# Altium project industrial_stepper_driver.PrjPcb
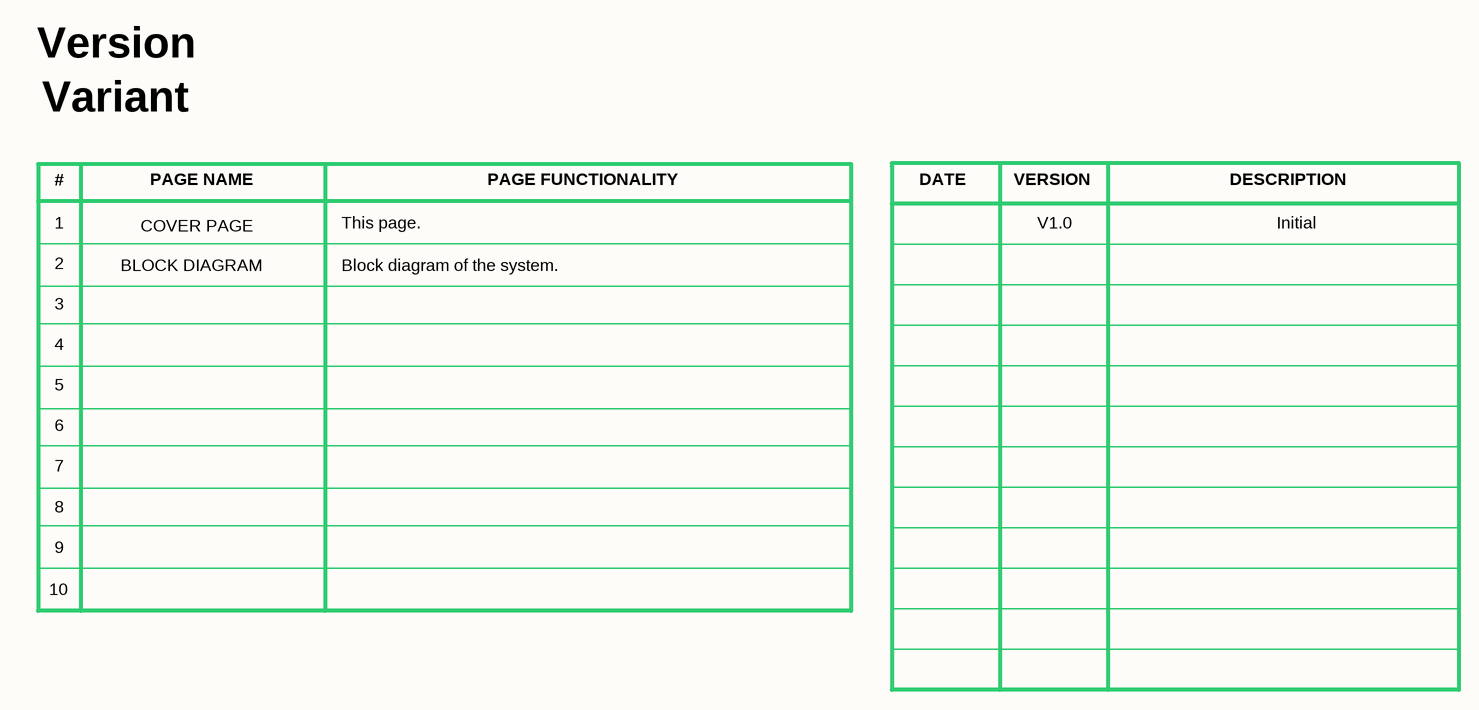
[diagram p0: 01 COVER PAGE.SchDoc]
Engineer_Email: contact@silardgal.com; Engineer_Link: https://www.silardgal.com; Engineer_Name: Silard Gal; Global_version: 1.0
6 sheets, 109 parts. Net scope: flat (ports and power ports of the same name join across sheets).
Board file: industrial_stepper_driver.PcbDoc
Sheets:
  01 COVER PAGE.SchDoc
  02 BLOCK DIAGRAM.SchDoc
  03 MCU.SchDoc
  04 DRIVER.SchDoc
  05 COMMUNICATION.SchDoc
  06 POWER.SchDoc

## Sheet 01 COVER PAGE.SchDoc: COVER PAGE
size 420 x 297 mm; SheetNumber: 1; SheetTotal: 5

### Notes on the sheet
- Version
- Variant
- #
- 1
- PAGE NAME
- COVER PAGE
- This page.
- PAGE FUNCTIONALITY
- DATE
- VERSION
- V1.0
- DESCRIPTION
- Initial
- 2
- 3
- BLOCK DIAGRAM
- Block diagram of the system.
- 4
- 5
- 6
- 7
- 8
- 9
- 10
- Title
- Project
- Size
- Date
- Revision
- A3
- Designed By

## Sheet 02 BLOCK DIAGRAM.SchDoc: BLOCK DIAGRAM
size 420 x 297 mm; SheetNumber: 2; SheetTotal: 5

### Notes on the sheet
- Title
- Project
- Size
- Date
- Revision
- A3
- Designed By

## Sheet 03 MCU.SchDoc: MCU
size 420 x 297 mm; SheetNumber: 3; SheetTotal: 6
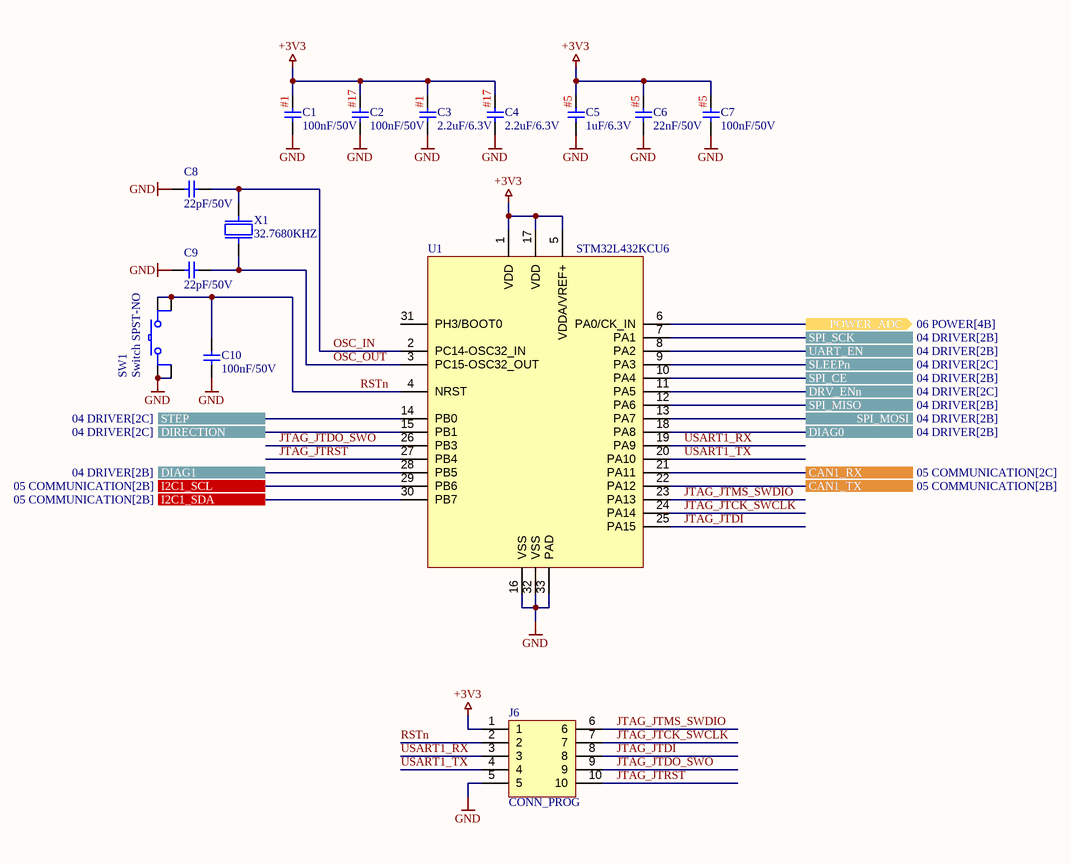
[diagram p1: 03 MCU.SchDoc]

### Parts
C1  100nF/50V  [CAPC1005X06M-0402]
C2  100nF/50V  [CAPC1005X06M-0402]
C3  2.2uF/6.3V  [CAPC1005X06M-0402]
C4  2.2uF/6.3V  [CAPC1005X06M-0402]
C5  1uF/6.3V  [CAPC1005X06M-0402]
C6  22nF/50V  [CAPC1005X06M-0402]
C7  100nF/50V  [CAPC1005X06M-0402]
C8  22pF/50V  [CAPC1005X06M-0402]
C9  22pF/50V  [CAPC1005X06M-0402]
C10  100nF/50V  [CAPC1005X06M-0402]
J6  CONN_PROG  [CONN_PROG]
SW1  Switch SPST-NO  [PTS815 SJM 250 SMTR LFS]
U1  STM32L432KCU6  [PQFN50P500X500X60_HS-33N]
X1  32.7680KHZ  [2-SMD]

### Ports
CAN1_RX (see 05 COMMUNICATION[2C]), CAN1_TX (see 05 COMMUNICATION[2B]), DIAG0 (see 04 DRIVER[2B]), DIAG1 (see 04 DRIVER[2B]), DIRECTION (see 04 DRIVER[2C]), DRV_ENn (see 04 DRIVER[2C]), I2C1_SCL (see 05 COMMUNICATION[2B]), I2C1_SDA (see 05 COMMUNICATION[2B]), POWER_ADC (out, see 06 POWER[4B]), SLEEPn (see 04 DRIVER[2C]), SPI_CE (see 04 DRIVER[2B]), SPI_MISO (see 04 DRIVER[2B]), SPI_MOSI (see 04 DRIVER[2B]), SPI_SCK (see 04 DRIVER[2B]), STEP (see 04 DRIVER[2C]), UART_EN (see 04 DRIVER[2B])

### Nets
+3V3: C1.2 C2.2 C3.2 C4.2 C5.2 C6.2 C7.2 J6.1 U1.1(VDD) U1.5(VDDA/VREF+) U1.17(VDD)
GND: C1.1 C2.1 C3.1 C4.1 C5.1 C6.1 C7.1 C8.1 C9.1 C10.1 J6.5 SW1.1 SW1.2 U1.16(VSS) U1.32(VSS) U1.33(PAD)
DIAG0: U1.18(PA8) ; port DIAG0
DIAG1: U1.28(PB5) ; port DIAG1
DIRECTION: U1.15(PB1) ; port DIRECTION
DRV_ENn: U1.11(PA5) ; port DRV_ENn
JTAG_JTCK_SWCLK: J6.7 U1.24(PA14)
JTAG_JTDI: J6.8 U1.25(PA15)
JTAG_JTDO_SWO: J6.9 U1.26(PB3)
JTAG_JTMS_SWDIO: J6.6 U1.23(PA13)
JTAG_JTRST: J6.10 U1.27(PB4)
OSC_IN: C8.2 U1.2(PC14-OSC32_IN) X1.2
OSC_OUT: C9.2 U1.3(PC15-OSC32_OUT) X1.1
RSTn: C10.2 J6.2 SW1.3 SW1.4 U1.4(NRST)
SLEEPn: U1.9(PA3) ; port SLEEPn
SPI_CE: U1.10(PA4) ; port SPI_CE
SPI_MISO: U1.12(PA6) ; port SPI_MISO
SPI_MOSI: U1.13(PA7) ; port SPI_MOSI
SPI_SCK: U1.7(PA1) ; port SPI_SCK
STEP: U1.14(PB0) ; port STEP
UART_EN: U1.8(PA2) ; port UART_EN
USART1_RX: J6.3 U1.19(PA9)
USART1_TX: J6.4 U1.20(PA10)
NetJ7_3: U1.30(PB7) ; port I2C1_SDA
NetJ7_4: U1.29(PB6) ; port I2C1_SCL
NetR17_2: U1.6(PA0/CK_IN) ; port POWER_ADC
NetU1_21: U1.21(PA11) ; port CAN1_RX
NetU1_22: U1.22(PA12) ; port CAN1_TX

Not connected (* = marked no-connect by the designer): U1 31(PH3/BOOT0)

### Notes on the sheet
- (near C1) #1
- (near C2) #17
- (near C3) #1
- (near C4) #17
- (near C5) #5
- (near C6) #5
- (near C7) #5
- Title
- Project
- Size
- Date
- Revision
- A3
- Designed By

### Library data of the parts
C1 C2 C7 C10 = GRM155R71H104KE14D: 0.1 µF ±10% 50V Ceramic Capacitor X7R 0402 (1005 Metric); ComponentLink1Description: Datasheet; ComponentLink1URL: https://search.murata.co.jp/Ceramy/image/img/A01X/G101/ENG/GRM155R60J475ME47-01.pdf; MPN: GRM155R71H104KE14D
C3 C4 = GRM155C80J225KE95D: 2.2 µF ±10% 6.3V Ceramic Capacitor X6S 0402 (1005 Metric); ComponentLink1Description: Datasheet; ComponentLink1URL: https://search.murata.co.jp/Ceramy/image/img/A01X/G101/ENG/GRM155R60J475ME47-01.pdf; MPN: GRM155C80J225KE95D
C5 = GRM155R70J105KA12J: 1 µF ±10% 6.3V Ceramic Capacitor X7R 0402 (1005 Metric); ComponentLink1Description: Datasheet; ComponentLink1URL: https://search.murata.co.jp/Ceramy/image/img/A01X/G101/ENG/GRM155R60J475ME47-01.pdf; MPN: GRM155R70J105KA12J
C6 = GRM155R71H223KA12D: 0.022 µF ±10% 50V Ceramic Capacitor X7R 0402 (1005 Metric); ComponentLink1Description: Datasheet; ComponentLink1URL: https://search.murata.co.jp/Ceramy/image/img/A01X/G101/ENG/GRM155R60J475ME47-01.pdf; MPN: GRM155R71H223KA12D
C8 C9 = GRM1555C1H220JA01D: 22 pF ±5% 50V Ceramic Capacitor C0G, NP0 0402 (1005 Metric); ComponentLink1Description: Datasheet; ComponentLink1URL: https://search.murata.co.jp/Ceramy/image/img/A01X/G101/ENG/GRM155R60J475ME47-01.pdf; MPN: GRM1555C1H220JA01D
SW1 = PTS815 SJM 250 SMTR LFS: Tactile Switch SPST-NO Top Actuated Surface Mount; ComponentLink1Description: Datasheet; ComponentLink1URL: https://www.ckswitches.com/media/2728/pts815.pdf; MPN: PTS815 SJM 250 SMTR LFS
U1 = STM32L432KCU6: ARM® Cortex®-M4 STM32L4 Microcontroller IC 32-Bit Single-Core 80MHz 256KB (256K x 8) FLASH 32-UFQFPN (5x5); ComponentLink1Description: Datasheet; ComponentLink1URL: https://www.st.com/content/ccc/resource/technical/document/datasheet/24/01/9f/59/f0/83/47/fc/DM00257205.pdf/files/DM00257205.pdf/jcr:content/translations/en.DM00257205.pdf; MPN: STM32L432KCU6
X1 = ECS-.327-12.5-16-TR: 32.768 kHz ±20ppm Crystal 12.5pF 90 kOhms 2-SMD, No Lead; ComponentLink1Description: Datasheet; ComponentLink1URL: https://ecsxtal.com/store/pdf/ECX-16.pdf; MPN: ECS-.327-12.5-16-TR
J6 = CONN_PROG: ComponentLink1Description: Datasheet; MPN: CONN_PROG

## Sheet 04 DRIVER.SchDoc: DRIVER
size 420 x 297 mm; SheetNumber: 4; SheetTotal: 6
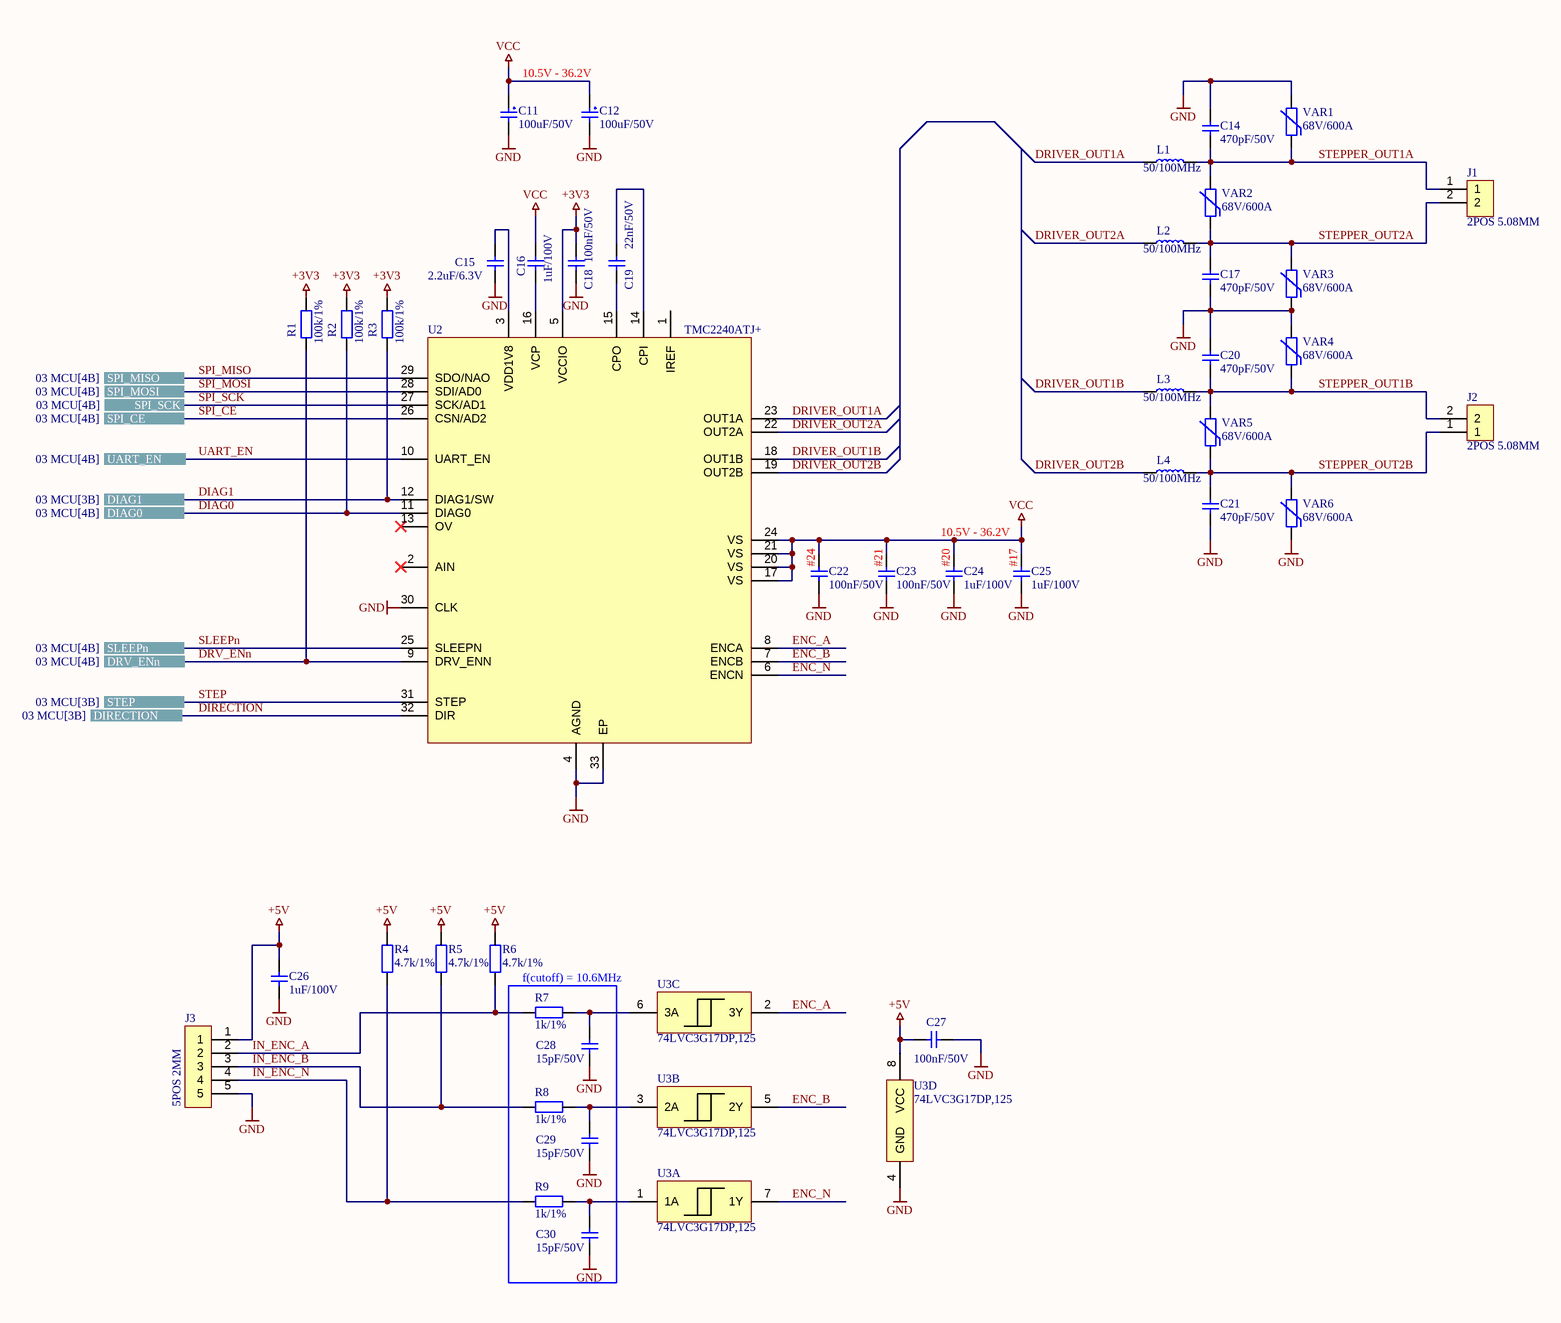
[diagram p2: 04 DRIVER.SchDoc]

### Parts
C11  100uF/50V  [A768KS107M1HLAE030]
C12  100uF/50V  [A768KS107M1HLAE030]
C14  470pF/50V  [CAPC1005X06M-0402]
C15  2.2uF/6.3V  [CAPC1005X06M-0402]
C16  1uF/100V  [CAPC2012X14M]
C17  470pF/50V  [CAPC1005X06M-0402]
C18  100nF/50V  [CAPC1005X06M-0402]
C19  22nF/50V  [CAPC1005X06M-0402]
C20  470pF/50V  [CAPC1005X06M-0402]
C21  470pF/50V  [CAPC1005X06M-0402]
C22  100nF/50V  [CAPC1005X06M-0402]
C23  100nF/50V  [CAPC1005X06M-0402]
C24  1uF/100V  [CAPC2012X14M]
C25  1uF/100V  [CAPC2012X14M]
C26  1uF/100V  [CAPC2012X14M]
C27  100nF/50V  [CAPC1005X06M-0402]
C28  15pF/50V  [CAPC1005X06M-0402]
C29  15pF/50V  [CAPC1005X06M-0402]
C30  15pF/50V  [CAPC1005X06M-0402]
J1  2POS 5.08MM  [282837-2]
J2  2POS 5.08MM  [282837-2]
J3  5POS 2MM  [B5B-PH-K-S]
L1  50/100MHz  [INDC3200X110-1206]
L2  50/100MHz  [INDC3200X110-1206]
L3  50/100MHz  [INDC3200X110-1206]
L4  50/100MHz  [INDC3200X110-1206]
R1  100k/1%  [RESC1005X04M-0402]
R2  100k/1%  [RESC1005X04M-0402]
R3  100k/1%  [RESC1005X04M-0402]
R4  4.7k/1%  [RESC1005X04M-0402]
R5  4.7k/1%  [RESC1005X04M-0402]
R6  4.7k/1%  [RESC1005X04M-0402]
R7  1k/1%  [RESC1005X04M-0402]
R8  1k/1%  [RESC1005X04M-0402]
R9  1k/1%  [RESC1005X04M-0402]
U2  TMC2240ATJ+  [TQFN32-5mmx5mm]
U3  74LVC3G17DP,125  [TSOP65P400X110-8N]  (parts A,B,C,D of 4)
VAR1  68V/600A  [VARA4732X16N]
VAR2  68V/600A  [VARA4732X16N]
VAR3  68V/600A  [VARA4732X16N]
VAR4  68V/600A  [VARA4732X16N]
VAR5  68V/600A  [VARA4732X16N]
VAR6  68V/600A  [VARA4732X16N]

### Blocks framed on the sheet
f(cutoff) = 10.6MHz: C28-C30 R7-R9

### Ports
DIAG0 (see 03 MCU[4B]), DIAG1 (see 03 MCU[3B]), DIRECTION (see 03 MCU[3B]), DRV_ENn (see 03 MCU[4B]), SLEEPn (see 03 MCU[4B]), SPI_CE (see 03 MCU[4B]), SPI_MISO (see 03 MCU[4B]), SPI_MOSI (see 03 MCU[4B]), SPI_SCK (see 03 MCU[4B]), STEP (see 03 MCU[3B]), UART_EN (see 03 MCU[4B])

### Nets
+3V3: C18.2 R1.2 R2.2 R3.2 U2.5(VCCIO)
+5V: C26.2 C27.1 J3.1 R4.2 R5.2 R6.2 U3.8(VCC)
GND: C11.2 C12.2 C14.1 C15.1 C17.2 C18.1 C20.1 C21.2 C22.1 C23.1 C24.1 C25.1 C26.1 C27.2 C28.1 C29.1 C30.1 J3.5 U2.4(AGND) U2.30(CLK) U2.33(EP) U3.4(GND) VAR1.2 VAR3.1 VAR4.2 VAR6.1
VCC: C11.1 C12.1 C16.2 C22.2 C23.2 C24.2 C25.2 U2.17(VS) U2.20(VS) U2.21(VS) U2.24(VS)
DIAG0: R2.1 U2.11(DIAG0) ; port DIAG0
DIAG1: R3.1 U2.12(DIAG1/SW) ; port DIAG1
DIRECTION: U2.32(DIR) ; port DIRECTION
DRIVER_OUT1A: L1.1 U2.23(OUT1A)
DRIVER_OUT1B: L3.1 U2.18(OUT1B)
DRIVER_OUT2A: L2.1 U2.22(OUT2A)
DRIVER_OUT2B: L4.1 U2.19(OUT2B)
DRV_ENn: R1.1 U2.9(DRV_ENN) ; port DRV_ENn
ENC_A: U2.8(ENCA) U3.2(3Y)
ENC_B: U2.7(ENCB) U3.5(2Y)
ENC_N: U2.6(ENCN) U3.7(1Y)
IN_ENC_A: J3.2 R6.1 R7.1
IN_ENC_B: J3.3 R5.1 R8.1
IN_ENC_N: J3.4 R4.1 R9.1
SLEEPn: U2.25(SLEEPN) ; port SLEEPn
SPI_CE: U2.26(CSN/AD2) ; port SPI_CE
SPI_MISO: U2.29(SDO/NAO) ; port SPI_MISO
SPI_MOSI: U2.28(SDI/AD0) ; port SPI_MOSI
SPI_SCK: U2.27(SCK/AD1) ; port SPI_SCK
STEP: U2.31(STEP) ; port STEP
STEPPER_OUT1A: C14.2 J1.1 L1.2 VAR1.1 VAR2.2
STEPPER_OUT1B: C20.2 J2.2 L3.2 VAR4.1 VAR5.2
STEPPER_OUT2A: C17.1 J1.2 L2.2 VAR2.1 VAR3.2
STEPPER_OUT2B: C21.1 J2.1 L4.2 VAR5.1 VAR6.2
UART_EN: U2.10(UART_EN) ; port UART_EN
NetC15_2: C15.2 U2.3(VDD1V8)
NetC16_1: C16.1 U2.16(VCP)
NetC19_1: C19.1 U2.15(CPO)
NetC19_2: C19.2 U2.14(CPI)
NetC28_2: C28.2 R7.2 U3.6(3A)
NetC29_2: C29.2 R8.2 U3.3(2A)
NetC30_2: C30.2 R9.2 U3.1(1A)

Not connected (* = marked no-connect by the designer): U2 1(IREF) 2(AIN)* 13(OV)*

### Notes on the sheet
- 10.5V - 36.2V
- (near C22) #24
- (near C23) #21
- (near C24) #20
- (near C25) #17
- Title
- Project
- Size
- Date
- Revision
- A3
- Designed By

### Library data of the parts
C11 C12 = A768KS107M1HLAE030: 100 µF 50 V Aluminum - Polymer Capacitors Radial, Can - SMD 30mOhm 2000 Hrs @ 125°C; ComponentLink1Description: Datasheet; ComponentLink1URL: https://connect.kemet.com:7667/gateway/IntelliData-ComponentDocumentation/1.0/download/datasheet/A768KS107M1HLAE030; MPN: A768KS107M1HLAE030
C14 C17 C20 C21 = GRM155R71H471KA01D: 470 pF ±10% 50V Ceramic Capacitor X7R 0402 (1005 Metric); ComponentLink1Description: Datasheet; ComponentLink1URL: https://search.murata.co.jp/Ceramy/image/img/A01X/G101/ENG/GRM155R60J475ME47-01.pdf; MPN: GRM155R71H471KA01D
C15 = GRM155C80J225KE95D: as C3 on sheet 03 MCU; ComponentLink1Description: Datasheet; ComponentLink1URL: https://search.murata.co.jp/Ceramy/image/img/A01X/G101/ENG/GRM155R60J475ME47-01.pdf; MPN: GRM155C80J225KE95D
C16 C24-C26 = GRM21BC72A105KE01L: 1 µF ±10% 100V Ceramic Capacitor X7S 0805 (2012 Metric); ComponentLink1Description: Datasheet; ComponentLink1URL: https://search.murata.co.jp/Ceramy/image/img/A01X/G101/ENG/GRM21BC72A105KE01-01.pdf; MPN: GRM21BC72A105KE01L
C18 C22 C23 C27 = GRM155R71H104KE14D: as C1 on sheet 03 MCU; ComponentLink1Description: Datasheet; ComponentLink1URL: https://search.murata.co.jp/Ceramy/image/img/A01X/G101/ENG/GRM155R60J475ME47-01.pdf; MPN: GRM155R71H104KE14D
C19 = GRM155R71H223KA12D: as C6 on sheet 03 MCU; ComponentLink1Description: Datasheet; ComponentLink1URL: https://search.murata.co.jp/Ceramy/image/img/A01X/G101/ENG/GRM155R60J475ME47-01.pdf; MPN: GRM155R71H223KA12D
C28-C30 = GRM1555C1H150JA01D: 15 pF ±5% 50V Ceramic Capacitor C0G, NP0 0402 (1005 Metric); ComponentLink1Description: Datasheet; ComponentLink1URL: https://search.murata.co.jp/Ceramy/image/img/A01X/G101/ENG/GRM155R60J475ME47-01.pdf; MPN: GRM1555C1H150JA01D
J1 J2 = 282837-2: MPN: 282834-3; ComponentLink1Description: Datasheet; ComponentLink1URL: https://www.te.com/commerce/DocumentDelivery/DDEController?Action=srchrtrv&DocNm=282834&DocType=Customer+Drawing&DocLang=English
J3 = B5B-PH-K-S: Connector Header Through Hole 5 position 0.079" (2.00mm); ComponentLink1Description: Datasheet; ComponentLink1URL: https://www.jst-mfg.com/product/pdf/eng/ePH.pdf; MPN: B5B-PH-K-S
L1-L4 = 742792114: 50 Ohms 1 Signal Line Ferrite Bead 1206 (3216 Metric) 3A 25mOhm; ComponentLink1Description: Datasheet; ComponentLink1URL: https://www.we-online.com/katalog/datasheet/742792114.pdf; MPN: 742792114
R1-R3 = RC0402FR-07100KL: 100 kOhms ±1% 0.063W, 1/16W Chip Resistor 0402 (1005 Metric) Moisture Resistant Thick Film; ComponentLink1Description: Datasheet; ComponentLink1URL: https://www.yageo.com/upload/media/product/productsearch/datasheet/rchip/PYu-RC_Group_51_RoHS_L_12.pdf; MPN: RC0402FR-07100KL
R4-R6 = RC0402FR-074K7L: 4.7 kOhms ±1% 0.063W, 1/16W Chip Resistor 0402 (1005 Metric) Moisture Resistant Thick Film; ComponentLink1Description: Datasheet; ComponentLink1URL: https://www.yageo.com/upload/media/product/productsearch/datasheet/rchip/PYu-RC_Group_51_RoHS_L_12.pdf; MPN: RC0402FR-074K7L
R7-R9 = RC0402FR-071KL: 1 kOhms ±1% 0.063W, 1/16W Chip Resistor 0402 (1005 Metric) Moisture Resistant Thick Film; ComponentLink1Description: Datasheet; ComponentLink1URL: https://www.yageo.com/upload/media/product/productsearch/datasheet/rchip/PYu-RC_Group_51_RoHS_L_12.pdf; MPN: RC0402FR-071KL
U2 = TMC2240ATJ+: Bipolar Motor Driver Power MOSFET SPI, UART 32-TQFN-EP (5x5); MPN: TMC2240ATJ+; ComponentLink1Description: Datasheet; ComponentLink1URL: http://mm.digikey.com/Volume0/opasdata/d220001/medias/docus/5344/TMC2240.pdf
U3 = 74LVC3G17DP,125: Buffer, Non-Inverting 3 Element 1 Bit per Element Push-Pull Output 8-TSSOP; ComponentLink1Description: Datasheet; ComponentLink1URL: https://assets.nexperia.com/documents/data-sheet/74LVC3G17.pdf; MPN: 74LVC3G17DP,125
VAR1-VAR6 = ZV40K1812601NIR1: 68 V 600 A Varistor 1 Circuit Surface Mount, MLCV 1812 (4532 Metric); ComponentLink1Description: Datasheet; ComponentLink1URL: https://www.bourns.com/docs/Product-Datasheets/ZV_series.pdf; MPN: ZV40K1812601NIR1

## Sheet 05 COMMUNICATION.SchDoc: COMMUNICATION
size 420 x 297 mm; SheetNumber: 5; SheetTotal: 6
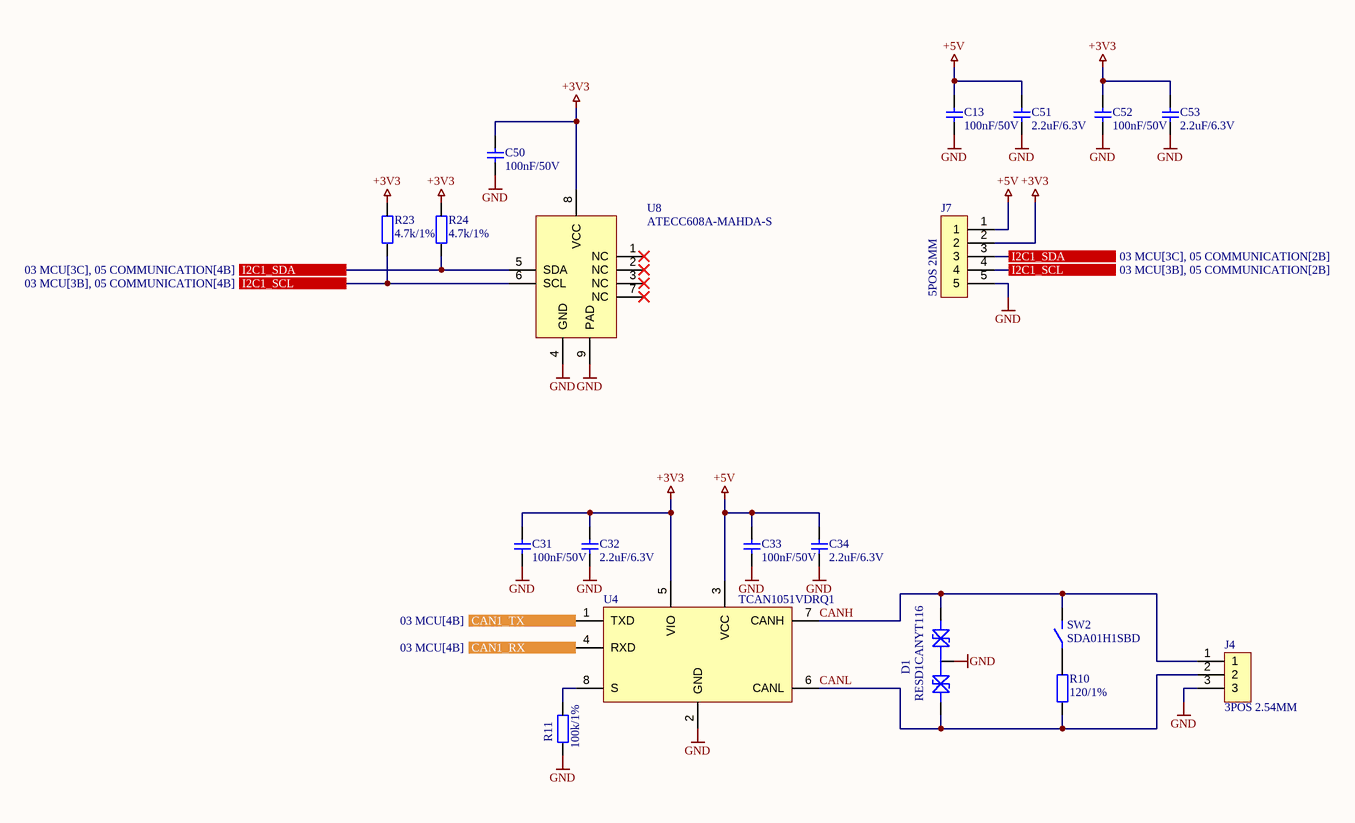
[diagram p3: 05 COMMUNICATION.SchDoc]

### Parts
C13  100nF/50V  [CAPC1005X06M-0402]
C31  100nF/50V  [CAPC1005X06M-0402]
C32  2.2uF/6.3V  [CAPC1005X06M-0402]
C33  100nF/50V  [CAPC1005X06M-0402]
C34  2.2uF/6.3V  [CAPC1005X06M-0402]
C50  100nF/50V  [CAPC1005X06M-0402]
C51  2.2uF/6.3V  [CAPC1005X06M-0402]
C52  100nF/50V  [CAPC1005X06M-0402]
C53  2.2uF/6.3V  [CAPC1005X06M-0402]
D1  RESD1CANYT116  [SOT100P240X115-3N]
J4  3POS 2.54MM  [282834-3]
J7  5POS 2MM  [B5B-PH-K-S]
R10  120/1%  [RESC1005X04M-0402]
R11  100k/1%  [RESC1005X04M-0402]
R23  4.7k/1%  [RESC1005X04M-0402]
R24  4.7k/1%  [RESC1005X04M-0402]
SW2  SDA01H1SBD  [SDA01H1SB]
U4  TCAN1051VDRQ1  [SOIC127P600X175-8N]
U8  ATECC608A-MAHDA-S  [SON50P200X60_HS-9N]

### Ports
CAN1_RX (see 03 MCU[4B]), CAN1_TX (see 03 MCU[4B]), I2C1_SCL (see 03 MCU[3B], 05 COMMUNICATION[2B]), I2C1_SCL (see 03 MCU[3B], 05 COMMUNICATION[4B]), I2C1_SDA (see 03 MCU[3C], 05 COMMUNICATION[2B]), I2C1_SDA (see 03 MCU[3C], 05 COMMUNICATION[4B])

### Nets
+3V3: C31.2 C32.2 C50.2 C52.2 C53.2 J7.2 R23.2 R24.2 U4.5(VIO) U8.8(VCC)
+5V: C13.2 C33.2 C34.2 C51.2 J7.1 U4.3(VCC)
GND: C13.1 C31.1 C32.1 C33.1 C34.1 C50.1 C51.1 C52.1 C53.1 D1.3 J4.3 J7.5 R11.1 U4.2(GND) U8.4(GND) U8.9(PAD)
CANH: D1.1 J4.1 SW2.2 U4.7(CANH)
CANL: D1.2 J4.2 R10.1 U4.6(CANL)
NetJ7_3: J7.3 R24.1 U8.5(SDA) ; port I2C1_SDA
NetJ7_4: J7.4 R23.1 U8.6(SCL) ; port I2C1_SCL
NetR10_2: R10.2 SW2.1
NetR11_2: R11.2 U4.8(S)
NetU1_21: U4.4(RXD) ; port CAN1_RX
NetU1_22: U4.1(TXD) ; port CAN1_TX

Not connected (* = marked no-connect by the designer): U8 1(NC)* 2(NC)* 3(NC)* 7(NC)*

### Notes on the sheet
- Title
- Project
- Size
- Date
- Revision
- A3
- Designed By

### Library data of the parts
C13 C31 C33 C50 C52 = GRM155R71H104KE14D: as C1 on sheet 03 MCU; ComponentLink1Description: Datasheet; ComponentLink1URL: https://search.murata.co.jp/Ceramy/image/img/A01X/G101/ENG/GRM155R60J475ME47-01.pdf; MPN: GRM155R71H104KE14D
C32 C34 C51 C53 = GRM155C80J225KE95D: as C3 on sheet 03 MCU; ComponentLink1Description: Datasheet; ComponentLink1URL: https://search.murata.co.jp/Ceramy/image/img/A01X/G101/ENG/GRM155R60J475ME47-01.pdf; MPN: GRM155C80J225KE95D
D1 = RESD1CANYT116: 44V Clamp 8A (8/20µs) Ipp Tvs Diode Surface Mount SOT-23; ComponentLink1Description: Datasheet; ComponentLink1URL: https://fscdn.rohm.com/en/products/databook/datasheet/discrete/diode/zener/resd1canyt116-e.pdf; MPN: RESD1CANYT116
J4 = 282834-3: 3 Position Wire to Board Terminal Block Horizontal with Board 0.100" (2.54mm) Through Hole; ComponentLink1Description: Datasheet; ComponentLink1URL: https://www.te.com/commerce/DocumentDelivery/DDEController?Action=srchrtrv&DocNm=282834&DocType=Customer+Drawing&DocLang=English; MPN: 282834-3
J7 = B5B-PH-K-S: as J3 on sheet 04 DRIVER; ComponentLink1Description: Datasheet; ComponentLink1URL: https://www.jst-mfg.com/product/pdf/eng/ePH.pdf; MPN: B5B-PH-K-S
R10 = RC0402FR-07120RL: 120 Ohms ±1% 0.063W, 1/16W Chip Resistor 0402 (1005 Metric) Moisture Resistant Thick Film; ComponentLink1Description: Datasheet; ComponentLink1URL: https://www.yageo.com/upload/media/product/productsearch/datasheet/rchip/PYu-RC_Group_51_RoHS_L_12.pdf; MPN: RC0402FR-07120RL
R11 = RC0402FR-07100KL: as R1 on sheet 04 DRIVER; ComponentLink1Description: Datasheet; ComponentLink1URL: https://www.yageo.com/upload/media/product/productsearch/datasheet/rchip/PYu-RC_Group_51_RoHS_L_12.pdf; MPN: RC0402FR-07100KL
R23 R24 = RC0402FR-074K7L: as R4 on sheet 04 DRIVER; ComponentLink1Description: Datasheet; ComponentLink1URL: https://www.yageo.com/upload/media/product/productsearch/datasheet/rchip/PYu-RC_Group_51_RoHS_L_12.pdf; MPN: RC0402FR-074K7L
SW2 = SDA01H1SBD: Dip Switch SPST 1 Position Surface Mount Slide (Standard) Actuator 25mA 24VDC; ComponentLink1Description: Datasheet; ComponentLink1URL: https://www.ckswitches.com/media/1327/sda.pdf; MPN: SDA01H1SBD
U4 = TCAN1051VDRQ1: 1/1 Transceiver Half CANbus 8-SOIC; ComponentLink1Description: Datasheet; ComponentLink1URL: https://www.ti.com/general/docs/suppproductinfo.tsp?distId=10&gotoUrl=https%3A%2F%2Fwww.ti.com%2Flit%2Fgpn%2Ftcan1051-q1; MPN: TCAN1051VDRQ1
U8 = ATECC608A-MAHDA-S: Authentication Chip 8-UDFN (2x3); MPN: ATECC608A-MAHDA-S; ComponentLink1Description: Datasheet; ComponentLink1URL: https://ww1.microchip.com/downloads/en/DeviceDoc/ATECC608A-CryptoAuthentication-Device-Summary-Data-Sheet-DS40001977B.pdf

## Sheet 06 POWER.SchDoc: POWER
size 420 x 297 mm; SheetNumber: 6; SheetTotal: 6
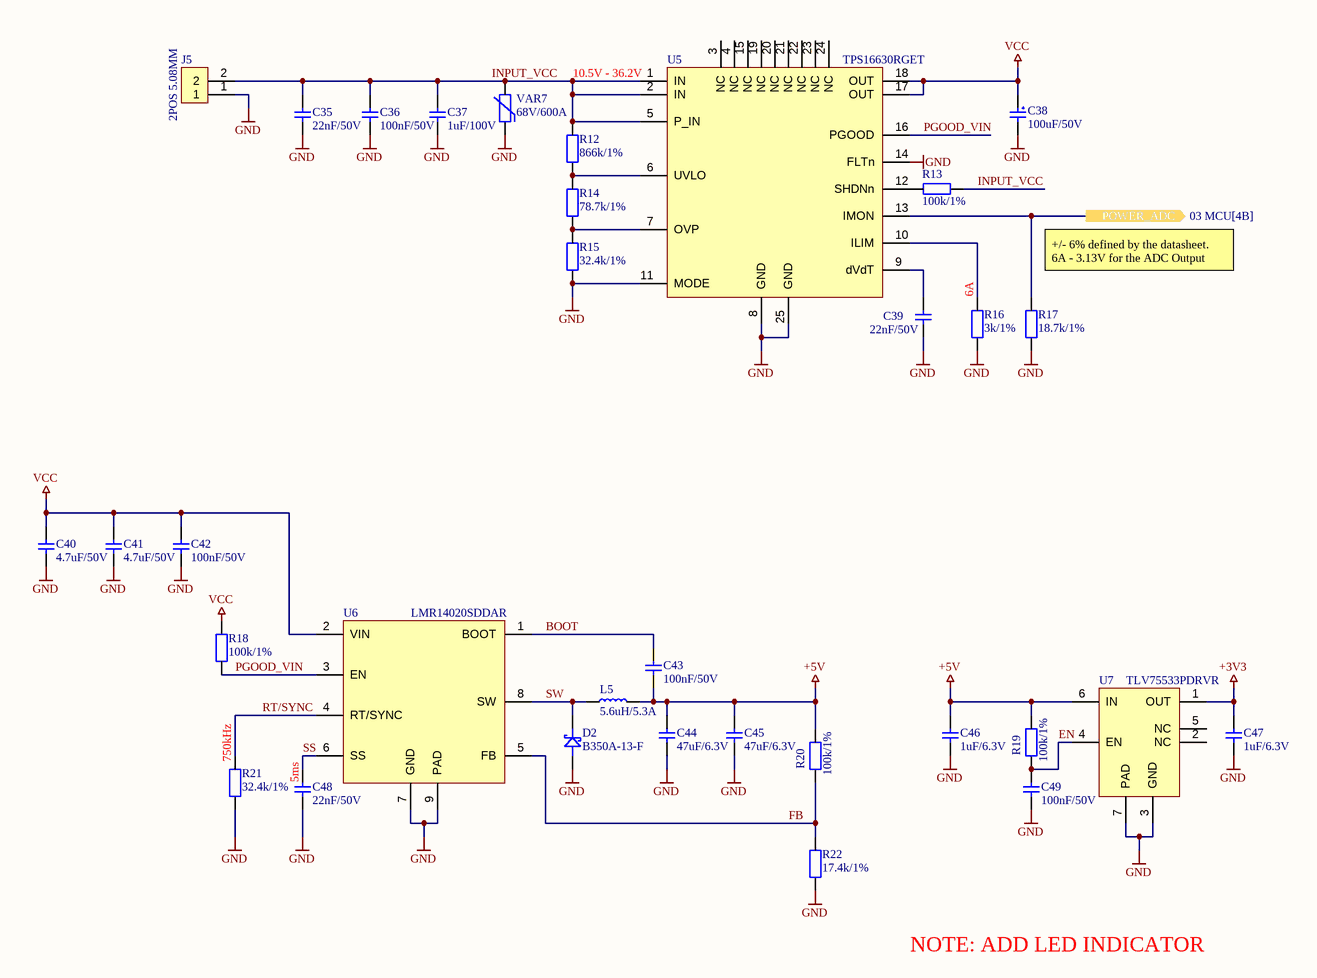
[diagram p4: 06 POWER.SchDoc]

### Parts
C35  22nF/50V  [CAPC1005X06M-0402]
C36  100nF/50V  [CAPC1005X06M-0402]
C37  1uF/100V  [CAPC2012X14M]
C38  100uF/50V  [A768KS107M1HLAE030]
C39  22nF/50V  [CAPC1005X06M-0402]
C40  4.7uF/50V  [CAPC2012X14M]
C41  4.7uF/50V  [CAPC2012X14M]
C42  100nF/50V  [CAPC1005X06M-0402]
C43  100nF/50V  [CAPC1005X06M-0402]
C44  47uF/6.3V  [CAPC1608X10M-0603]
C45  47uF/6.3V  [CAPC1608X10M-0603]
C46  1uF/6.3V  [CAPC1005X06M-0402]
C47  1uF/6.3V  [CAPC1005X06M-0402]
C48  22nF/50V  [CAPC1005X06M-0402]
C49  100nF/50V  [CAPC1005X06M-0402]
D2  B350A-13-F  [SMA]
J5  2POS 5.08MM  [282837-2]
L5  5.6uH/5.3A  [IHLP2525CZER5R6M8A]
R12  866k/1%  [RESC1005X04M-0402]
R13  100k/1%  [RESC1005X04M-0402]
R14  78.7k/1%  [RESC1005X04M-0402]
R15  32.4k/1%  [RESC1005X04M-0402]
R16  3k/1%  [RESC1005X04M-0402]
R17  18.7k/1%  [RESC1005X04M-0402]
R18  100k/1%  [RESC1005X04M-0402]
R19  100k/1%  [RESC1005X04M-0402]
R20  100k/1%  [RESC1005X04M-0402]
R21  32.4k/1%  [RESC1005X04M-0402]
R22  17.4k/1%  [RESC1005X04M-0402]
U5  TPS16630RGET  [PQFN50P400X400X100_HS-25N]
U6  LMR14020SDDAR  [SOIC127P600X170_HS-9N]
U7  TLV75533PDRVR  [SON65P200X80_HS-7N]
VAR7  68V/600A  [VARA4732X16N]

### Ports
POWER_ADC (out, see 03 MCU[4B])

### Nets
+3V3: C47.2 U7.1(OUT)
+5V: C43.1 C44.2 C45.2 C46.2 L5.2 R19.2 R20.2 U7.6(IN)
GND: C35.1 C36.1 C37.1 C38.2 C39.1 C40.1 C41.1 C42.1 C44.1 C45.1 C46.1 C47.1 C48.2 C49.1 D2.2 J5.1 R15.1 R16.1 R17.1 R21.1 R22.1 U5.8(GND) U5.11(MODE) U5.14(FLTn) U5.25(GND) U6.7(GND) U6.9(PAD) U7.3(GND) U7.7(PAD) VAR7.1
VCC: C38.1 C40.2 C41.2 C42.2 R18.1 U5.17(OUT) U5.18(OUT) U6.2(VIN)
BOOT: C43.2 U6.1(BOOT)
EN: C49.2 R19.1 U7.4(EN)
FB: R20.1 R22.2 U6.5(FB)
INPUT_VCC: C35.2 C36.2 C37.2 J5.2 R12.2 R13.1 U5.1(IN) U5.2(IN) U5.5(P_IN) VAR7.2
PGOOD_VIN: R18.2 U5.16(PGOOD) U6.3(EN)
RT/SYNC: R21.2 U6.4(RT/SYNC)
SS: C48.1 U6.6(SS)
SW: D2.1 L5.1 U6.8(SW)
NetC39_2: C39.2 U5.9(dVdT)
NetR12_1: R12.1 R14.2 U5.6(UVLO)
NetR13_2: R13.2 U5.12(SHDNn)
NetR14_1: R14.1 R15.2 U5.7(OVP)
NetR16_2: R16.2 U5.10(ILIM)
NetR17_2: R17.2 U5.13(IMON) ; port POWER_ADC

Not connected (* = marked no-connect by the designer): U5 3(NC) 4(NC) 15(NC) 19(NC) 20(NC) 21(NC) 22(NC) 23(NC) 24(NC); U7 2(NC) 5(NC)

### Notes on the sheet
- (near U5) 10.5V - 36.2V
- (near R16) 6A
- (near R17) +/- 6% defined by the datasheet.
  6A - 3.13V for the ADC Output
- (near R21) 750kHz
- (near C48) 5ms
- NOTE: ADD LED INDICATOR
- Title
- Project
- Size
- Date
- Revision
- A3
- Designed By

### Library data of the parts
C35 C39 C48 = GRM155R71H223KA12D: as C6 on sheet 03 MCU; ComponentLink1Description: Datasheet; ComponentLink1URL: https://search.murata.co.jp/Ceramy/image/img/A01X/G101/ENG/GRM155R60J475ME47-01.pdf; MPN: GRM155R71H223KA12D
C36 C42 C43 C49 = GRM155R71H104KE14D: as C1 on sheet 03 MCU; ComponentLink1Description: Datasheet; ComponentLink1URL: https://search.murata.co.jp/Ceramy/image/img/A01X/G101/ENG/GRM155R60J475ME47-01.pdf; MPN: GRM155R71H104KE14D
C37 = GRM21BC72A105KE01L: as C16 on sheet 04 DRIVER; ComponentLink1Description: Datasheet; ComponentLink1URL: https://search.murata.co.jp/Ceramy/image/img/A01X/G101/ENG/GRM21BC72A105KE01-01.pdf; MPN: GRM21BC72A105KE01L
C38 = A768KS107M1HLAE030: as C11 on sheet 04 DRIVER; ComponentLink1Description: Datasheet; ComponentLink1URL: https://connect.kemet.com:7667/gateway/IntelliData-ComponentDocumentation/1.0/download/datasheet/A768KS107M1HLAE030; MPN: A768KS107M1HLAE030
C40 C41 = GRM21BR61H475KE51L: 4.7 µF ±10% 50V Ceramic Capacitor X5R 0805 (2012 Metric); ComponentLink1Description: Datasheet; ComponentLink1URL: https://search.murata.co.jp/Ceramy/image/img/A01X/G101/ENG/GRM21BC72A105KE01-01.pdf; MPN: GRM21BR61H475KE51L
C44 C45 = GRM188R60J476ME15D: 47 µF ±20% 6.3V Ceramic Capacitor X5R 0603 (1608 Metric); ComponentLink1Description: Datasheet; ComponentLink1URL: https://search.murata.co.jp/Ceramy/image/img/A01X/G101/ENG/GRM188R60J476ME15-01.pdf; MPN: GRM188R60J476ME15D
C46 C47 = GRM155R70J105KA12J: as C5 on sheet 03 MCU; ComponentLink1Description: Datasheet; ComponentLink1URL: https://search.murata.co.jp/Ceramy/image/img/A01X/G101/ENG/GRM155R60J475ME47-01.pdf; MPN: GRM155R70J105KA12J
D2 = B350A-13-F: Diode 50 V 3A Surface Mount SMA; ComponentLink1Description: Datasheet; ComponentLink1URL: https://www.diodes.com/assets/Datasheets/ds30891.pdf; MPN: B350A-13-F
J5 = 282837-2: MPN: 282834-3; ComponentLink1Description: Datasheet; ComponentLink1URL: https://www.te.com/commerce/DocumentDelivery/DDEController?Action=srchrtrv&DocNm=282834&DocType=Customer+Drawing&DocLang=English
L5 = IHLP2525CZER5R6M8A: 5.6 µH Shielded Molded Inductor 5.3 A 45.6mOhm Max Nonstandard; ComponentLink1Description: Datasheet; ComponentLink1URL: https://www.vishay.com/docs/34362/lp25cz8a.pdf; MPN: IHLP2525CZER5R6M8A
R12 = RC0402FR-07866KL: 866 kOhms ±1% 0.063W, 1/16W Chip Resistor 0402 (1005 Metric) Moisture Resistant Thick Film; ComponentLink1Description: Datasheet; ComponentLink1URL: https://www.yageo.com/upload/media/product/productsearch/datasheet/rchip/PYu-RC_Group_51_RoHS_L_12.pdf; MPN: RC0402FR-07866KL
R13 R18-R20 = RC0402FR-07100KL: as R1 on sheet 04 DRIVER; ComponentLink1Description: Datasheet; ComponentLink1URL: https://www.yageo.com/upload/media/product/productsearch/datasheet/rchip/PYu-RC_Group_51_RoHS_L_12.pdf; MPN: RC0402FR-07100KL
R14 = RC0402FR-0778K7L: 78.7 kOhms ±1% 0.063W, 1/16W Chip Resistor 0402 (1005 Metric) Moisture Resistant Thick Film; ComponentLink1Description: Datasheet; ComponentLink1URL: https://www.yageo.com/upload/media/product/productsearch/datasheet/rchip/PYu-RC_Group_51_RoHS_L_12.pdf; MPN: RC0402FR-0778K7L
R15 R21 = RC0402FR-0732K4L: 32.4 kOhms ±1% 0.063W, 1/16W Chip Resistor 0402 (1005 Metric) Moisture Resistant Thick Film; MPN: RC0402FR-0718K7L; ComponentLink1Description: Datasheet; ComponentLink1URL: https://www.yageo.com/upload/media/product/productsearch/datasheet/rchip/PYu-RC_Group_51_RoHS_L_12.pdf
R16 = RC0402FR-073KL: 3 kOhms ±1% 0.063W, 1/16W Chip Resistor 0402 (1005 Metric) Moisture Resistant Thick Film; ComponentLink1Description: Datasheet; ComponentLink1URL: https://www.yageo.com/upload/media/product/productsearch/datasheet/rchip/PYu-RC_Group_51_RoHS_L_12.pdf; MPN: RC0402FR-073KL
R17 = RC0402FR-0718K7L: 18.7 kOhms ±1% 0.063W, 1/16W Chip Resistor 0402 (1005 Metric) Moisture Resistant Thick Film; ComponentLink1Description: Datasheet; ComponentLink1URL: https://www.yageo.com/upload/media/product/productsearch/datasheet/rchip/PYu-RC_Group_51_RoHS_L_12.pdf; MPN: RC0402FR-0718K7L
R22 = RC0402FR-0717K4L: 17.4 kOhms ±1% 0.063W, 1/16W Chip Resistor 0402 (1005 Metric) Moisture Resistant Thick Film; ComponentLink1Description: Datasheet; ComponentLink1URL: https://www.yageo.com/upload/media/product/productsearch/datasheet/rchip/PYu-RC_Group_51_RoHS_L_12.pdf; MPN: RC0402FR-0717K4L
U5 = TPS16630RGET: Electronic Fuse Regulator 6A 24-VQFN (4x4); ComponentLink1Description: Datasheet; ComponentLink1URL: https://www.ti.com/general/docs/suppproductinfo.tsp?distId=10&gotoUrl=https%3A%2F%2Fwww.ti.com%2Flit%2Fgpn%2Ftps1663; MPN: TPS16630RGET
U6 = LMR14020SDDAR: Buck Switching Regulator IC Positive Adjustable 0.8V 1 Output 2A 8-PowerSOIC (0.154", 3.90mm Width); MPN: LMR14020SDDAR; ComponentLink1Description: Datasheet; ComponentLink1URL: https://www.ti.com/general/docs/suppproductinfo.tsp?distId=10&gotoUrl=http%253A%252F%252Fwww.ti.com%252Flit%252Fgpn%252Flmr14020
U7 = TLV75533PDRVR: Linear Voltage Regulator IC Positive Fixed 1 Output 500mA 6-WSON (2x2); ComponentLink1Description: Datasheet; ComponentLink1URL: https://www.ti.com/general/docs/suppproductinfo.tsp?distId=10&gotoUrl=https%3A%2F%2Fwww.ti.com%2Flit%2Fgpn%2Ftlv755p; MPN: TLV75533PDRVR
VAR7 = ZV40K1812601NIR1: as VAR1 on sheet 04 DRIVER; ComponentLink1Description: Datasheet; ComponentLink1URL: https://www.bourns.com/docs/Product-Datasheets/ZV_series.pdf; MPN: ZV40K1812601NIR1

## Nets that join several sheets
+3V3: 03 MCU (11 pins), 04 DRIVER (5 pins), 05 COMMUNICATION (10 pins), 06 POWER (C47.2 U7.1)
+5V: 04 DRIVER (7 pins), 05 COMMUNICATION (6 pins), 06 POWER (8 pins)
GND: 03 MCU (16 pins), 04 DRIVER (26 pins), 05 COMMUNICATION (16 pins), 06 POWER (30 pins)
VCC: 04 DRIVER (11 pins), 06 POWER (8 pins)
DIAG0: 03 MCU (U1.18), 04 DRIVER (R2.1 U2.11)
DIAG1: 03 MCU (U1.28), 04 DRIVER (R3.1 U2.12)
DIRECTION: 03 MCU (U1.15), 04 DRIVER (U2.32)
DRV_ENn: 03 MCU (U1.11), 04 DRIVER (R1.1 U2.9)
NetJ7_3: 03 MCU (U1.30), 05 COMMUNICATION (J7.3 R24.1 U8.5)
NetJ7_4: 03 MCU (U1.29), 05 COMMUNICATION (J7.4 R23.1 U8.6)
NetR17_2: 03 MCU (U1.6), 06 POWER (R17.2 U5.13)
NetU1_21: 03 MCU (U1.21), 05 COMMUNICATION (U4.4)
NetU1_22: 03 MCU (U1.22), 05 COMMUNICATION (U4.1)
SLEEPn: 03 MCU (U1.9), 04 DRIVER (U2.25)
SPI_CE: 03 MCU (U1.10), 04 DRIVER (U2.26)
SPI_MISO: 03 MCU (U1.12), 04 DRIVER (U2.29)
SPI_MOSI: 03 MCU (U1.13), 04 DRIVER (U2.28)
SPI_SCK: 03 MCU (U1.7), 04 DRIVER (U2.27)
STEP: 03 MCU (U1.14), 04 DRIVER (U2.31)
UART_EN: 03 MCU (U1.8), 04 DRIVER (U2.10)